# EAGLE schematic RPi-Kids-alarm-MQTT (EAGLE 9.4.2)
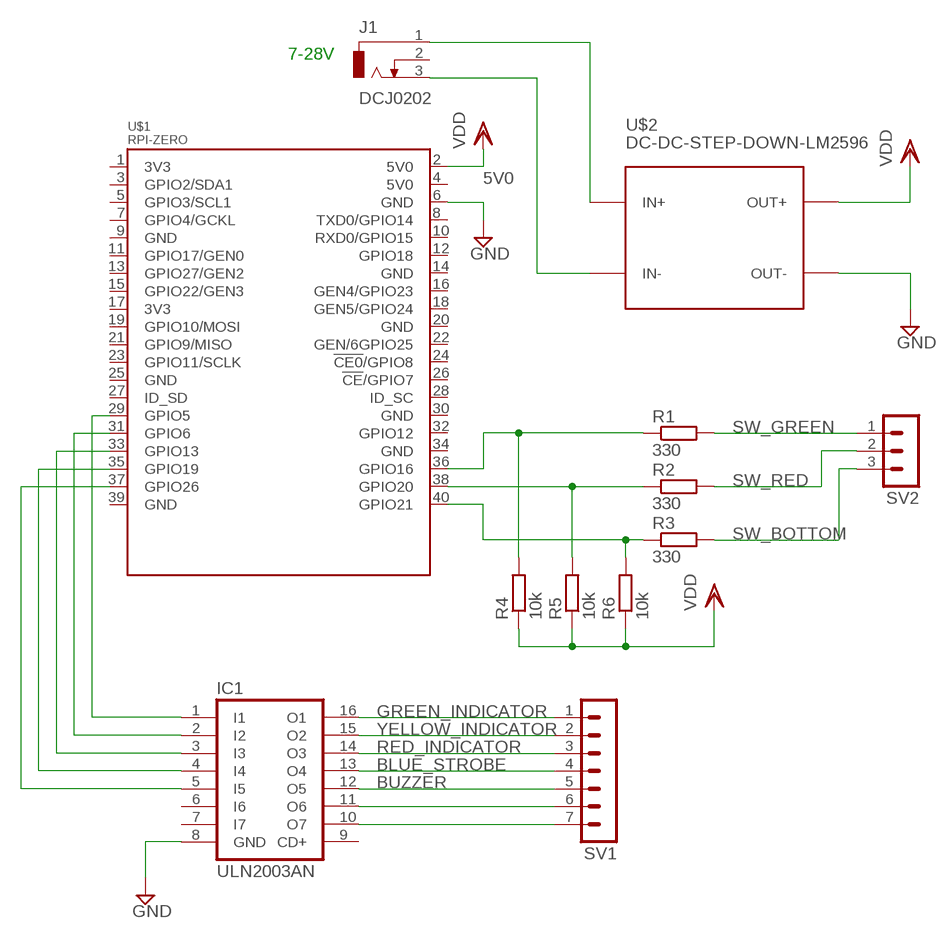
[diagram p0: schematic, sheet 1]

## Parts
IC1  ULN2003AN  [DIL16]
J1  DCJ0202  [DCJ0202]
R1  330  R-EU_0204/7  [0204/7]
R2  330  R-EU_0204/7  [0204/7]
R3  330  R-EU_0204/7  [0204/7]
R4  10k  R-EU_0204/7  [0204/7]
R5  10k  R-EU_0204/7  [0204/7]
R6  10k  R-EU_0204/7  [0204/7]
SV1  MA07-1  [MA07-1]
SV2  MA03-1  [MA03-1]
U$1  RPI-ZERO  [RASPBERRYPI_BASTELSTUBE_V13_RASPI_BOARD_B+_FULL]
U$2  DC-DC-STEP-DOWN-LM2596  [DC-DC-STEP-DOWN-LM2596]

## Nets
5V0: U$1.2(5V0) ; supply symbol labelled VDD
BLUE_STROBE: IC1.13(O4) SV1.4
BUZZER: IC1.12(O5) SV1.5
GND: IC1.8(GND) U$2.OUT-
GND@8: U$1.6(GND) ; supply symbol labelled GND
GREEN_INDICATOR: IC1.16(O1) SV1.1
N$1: R1.1 R4.2 U$1.36(GPIO16)
N$2: R2.1 R5.2 U$1.38(GPIO20)
N$3: R3.1 R6.2 U$1.40(GPIO21)
N$6: J1.3 U$2.IN-
N$7: J1.1 U$2.IN+
N$8: IC1.1(I1) U$1.29(GPIO5)
N$9: IC1.2(I2) U$1.31(GPIO6)
N$10: IC1.3(I3) U$1.33(GPIO13)
N$11: IC1.4(I4) U$1.35(GPIO19)
N$12: IC1.5(I5) U$1.37(GPIO26)
N$14: IC1.11(O6) SV1.6
N$15: IC1.10(O7) SV1.7
RED_INDICATOR: IC1.14(O3) SV1.3
SW_BOTTOM: R3.2 SV2.3
SW_GREEN: R1.2 SV2.1
SW_RED: R2.2 SV2.2
VDD: R4.1 R5.1 R6.1 U$2.OUT+
YELLOW_INDICATOR: IC1.15(O2) SV1.2
Unconnected: IC1.6(I6) IC1.7(I7) IC1.9(CD+) J1.2 U$1.1(3V3) U$1.3(GPIO2/SDA1) U$1.4(5V0) U$1.5(GPIO3/SCL1) U$1.7(GPIO4/GCKL) U$1.8(TXD0/GPIO14) U$1.9(GND) U$1.10(RXD0/GPIO15) U$1.11(GPIO17/GEN0) U$1.12(GPIO18) U$1.13(GPIO27/GEN2) U$1.14(GND) U$1.15(GPIO22/GEN3) U$1.16(GEN4/GPIO23) U$1.17(3V3) U$1.18(GEN5/GPIO24) U$1.19(GPIO10/MOSI) U$1.20(GND) U$1.21(GPIO9/MISO) U$1.22(GEN/6GPIO25) U$1.23(GPIO11/SCLK) U$1.24(!CE0!/GPIO8) U$1.25(GND) U$1.26(!CE!/GPIO7) U$1.27(ID_SD) U$1.28(ID_SC) U$1.30(GND) U$1.32(GPIO12) U$1.34(GND) U$1.39(GND)

## Notes on the sheet
- 7-28V

## Library data of the parts
IC1 = uln-udn:ULN2003A: DRIVER ARRAY
J1 = con-jack:DCJ0202: DC POWER JACK Source: DCJ0202.pdf; OC_FARNELL: unknown; OC_NEWARK: unknown
R1-R6 = resistor:R-EU_: RESISTOR, European symbol
SV1 = con-lstb:MA07-1: PIN HEADER; OC_FARNELL: unknown; OC_NEWARK: unknown
SV2 = con-lstb:MA03-1: PIN HEADER; OC_FARNELL: unknown; OC_NEWARK: unknown
U$1 = RPI-Zero:RPI-ZERO
U$2 = diy-modules:DC-DC-STEP-DOWN-LM2596: DC/DC Step-Down Regulator based on LM2596-ADJ chip LM2596 datasheet available here: http://www.ti.com/lit/ds/symlink/lm2596.pdf Click here to find device on ebay.com <http://www.ebay.com/sch/lm2596+power+regulator>